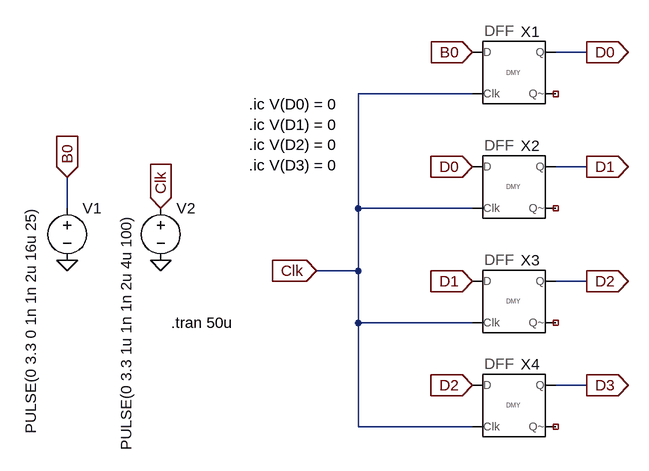
[diagram p0: schematic Shift_Right_Register_test.asc]
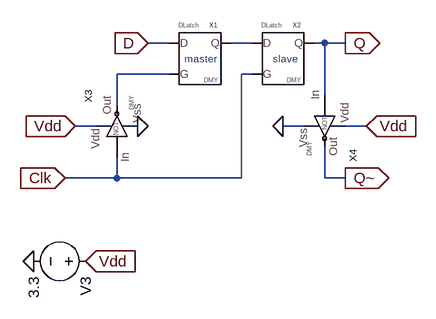
[diagram p1: sub-circuit dff.asc]
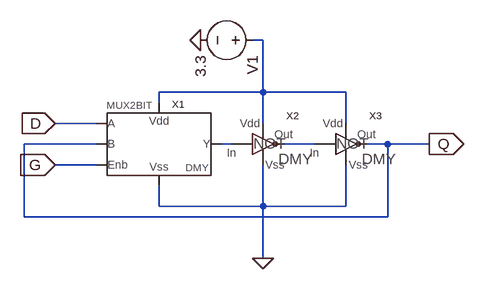
[diagram p2: sub-circuit d-latch.asc]
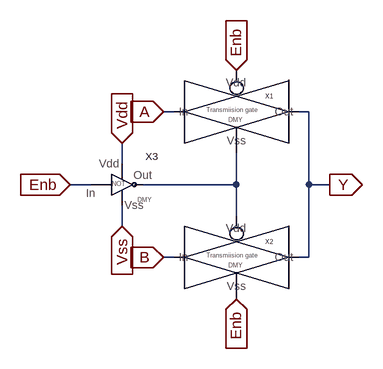
[diagram p3: sub-circuit mux2-1.asc]
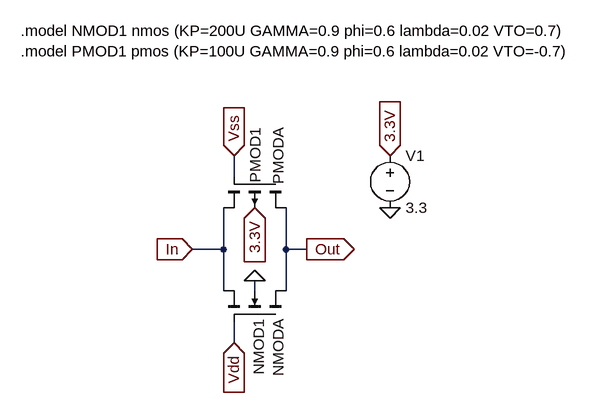
[diagram p4: sub-circuit transmissiongate.asc]
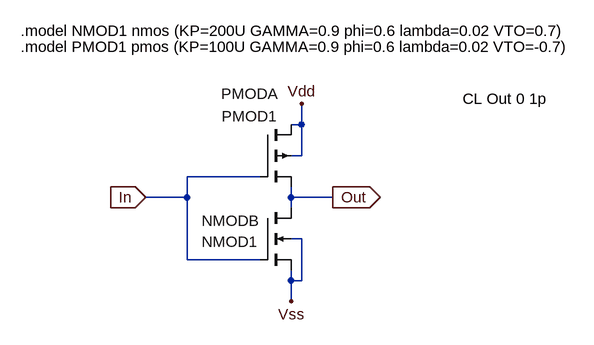
[diagram p5: sub-circuit not.asc]
Shift_Right_Register_test.asc, the LTspice schematic file:
Version 4
SHEET 1 880 792
WIRE 752 -304 704 -304
WIRE 576 -240 400 -240
WIRE 752 -128 704 -128
WIRE -48 -64 -48 -112
WIRE 400 -64 400 -240
WIRE 576 -64 400 -64
WIRE 400 32 400 -64
WIRE 400 32 336 32
WIRE 752 48 704 48
WIRE 400 112 400 32
WIRE 576 112 400 112
WIRE 752 208 704 208
WIRE 400 272 400 112
WIRE 576 272 400 272
FLAG -48 16 0
FLAG 96 16 0
FLAG -48 -112 B0
IOPIN -48 -112 In
FLAG 96 -64 Clk
IOPIN 96 -64 In
FLAG 576 -304 B0
IOPIN 576 -304 In
FLAG 576 -128 D0
IOPIN 576 -128 In
FLAG 576 48 D1
IOPIN 576 48 In
FLAG 576 208 D2
IOPIN 576 208 In
FLAG 336 32 Clk
IOPIN 336 32 In
FLAG 752 -304 D0
IOPIN 752 -304 Out
FLAG 752 -128 D1
IOPIN 752 -128 Out
FLAG 752 48 D2
IOPIN 752 48 Out
FLAG 752 208 D3
IOPIN 752 208 Out
SYMBOL voltage -48 -80 R0
WINDOW 3 -56 12 VRight 2
WINDOW 123 0 0 Left 0
WINDOW 39 0 0 Left 0
SYMATTR Value PULSE(0 3.3 0 1n 1n 2u 16u 25)
SYMATTR InstName V1
SYMBOL voltage 96 -80 R0
WINDOW 3 -53 24 VRight 2
WINDOW 123 0 0 Left 0
WINDOW 39 0 0 Left 0
SYMATTR Value PULSE(0 3.3 1u 1n 1n 2u 4u 100)
SYMATTR InstName V2
SYMBOL DFF 624 -288 R0
SYMATTR InstName X1
SYMBOL DFF 624 -112 R0
SYMATTR InstName X2
SYMBOL DFF 624 64 R0
SYMATTR InstName X3
SYMBOL DFF 624 224 R0
SYMATTR InstName X4
TEXT 112 112 Left 2 !.tran 50u
TEXT 232 -224 Left 2 !.ic V(D0) = 0\n.ic V(D1) = 0\n.ic V(D2) = 0\n.ic V(D3) = 0

dff.asc, the sub-circuit schematic file:
Version 4
SHEET 1 880 680
WIRE 240 128 208 128
WIRE 368 128 336 128
WIRE 480 128 464 128
WIRE 512 128 480 128
WIRE 240 176 160 176
WIRE 368 176 352 176
WIRE 480 208 480 128
WIRE 160 224 160 176
WIRE 128 256 96 256
WIRE 448 256 416 256
WIRE 544 256 512 256
WIRE 160 336 160 304
WIRE 160 336 80 336
WIRE 352 336 352 176
WIRE 352 336 160 336
WIRE 480 336 480 288
WIRE 512 336 480 336
FLAG 80 336 Clk
IOPIN 80 336 In
FLAG 208 128 D
IOPIN 208 128 In
FLAG 512 128 Q
IOPIN 512 128 Out
FLAG 32 464 0
FLAG 96 256 Vdd
IOPIN 96 256 In
FLAG 112 464 Vdd
IOPIN 112 464 In
FLAG 512 336 Q~
IOPIN 512 336 Out
FLAG 544 256 Vdd
IOPIN 544 256 In
FLAG 416 256 0
FLAG 192 256 0
SYMBOL D-Latch 288 160 R0
SYMATTR InstName X1
SYMBOL D-Latch 416 160 R0
SYMATTR InstName X2
SYMBOL NOT 160 272 R270
SYMATTR InstName X3
SYMBOL voltage 128 464 R90
WINDOW 123 0 0 Left 0
WINDOW 39 0 0 Left 0
SYMATTR InstName V3
SYMATTR Value 3.3
SYMBOL NOT 480 240 R90
SYMATTR InstName X4
TEXT 264 152 Left 1 ;master
TEXT 400 152 Left 1 ;slave

d-latch.asc, the sub-circuit schematic file:
Version 4
SHEET 1 880 680
WIRE 400 16 384 16
WIRE 400 96 400 16
WIRE 400 96 240 96
WIRE 528 96 400 96
WIRE 240 112 240 96
WIRE 144 144 80 144
WIRE 400 144 400 96
WIRE 528 144 528 96
WIRE 144 176 32 176
WIRE 352 176 336 176
WIRE 480 176 432 176
WIRE 592 176 560 176
WIRE 656 176 592 176
WIRE 144 208 80 208
WIRE 240 272 240 240
WIRE 400 272 400 208
WIRE 400 272 240 272
WIRE 528 272 528 208
WIRE 528 272 400 272
WIRE 32 288 32 176
WIRE 592 288 592 176
WIRE 592 288 32 288
WIRE 400 352 400 272
FLAG 656 176 Q
IOPIN 656 176 Out
FLAG 80 144 D
IOPIN 80 144 In
FLAG 80 208 G
IOPIN 80 208 In
FLAG 400 352 0
FLAG 304 16 0
SYMBOL MUX2-1 256 176 R0
SYMATTR InstName X1
SYMBOL NOT 384 176 R0
SYMATTR InstName X2
SYMBOL NOT 512 176 R0
SYMATTR InstName X3
SYMBOL voltage 400 16 R90
WINDOW 123 0 0 Left 0
WINDOW 39 0 0 Left 0
SYMATTR InstName V1
SYMATTR Value 3.3

mux2-1.asc, the sub-circuit schematic file:
Version 4
SHEET 1 880 680
WIRE 96 112 80 112
WIRE 304 112 288 112
WIRE 16 192 16 160
WIRE -32 224 -64 224
WIRE 192 224 192 176
WIRE 192 224 48 224
WIRE 304 224 304 112
WIRE 336 224 304 224
WIRE 192 272 192 224
WIRE 16 288 16 256
WIRE 96 336 80 336
WIRE 304 336 304 224
WIRE 304 336 288 336
FLAG -64 224 Enb
IOPIN -64 224 In
FLAG 80 112 A
IOPIN 80 112 In
FLAG 80 336 B
IOPIN 80 336 In
FLAG 192 400 Enb
IOPIN 192 400 In
FLAG 192 48 Enb
IOPIN 192 48 In
FLAG 336 224 Y
IOPIN 336 224 Out
FLAG 16 160 Vdd
IOPIN 16 160 In
FLAG 16 288 Vss
IOPIN 16 288 In
SYMBOL TransmissionGate 176 112 R0
SYMATTR InstName X1
SYMBOL TransmissionGate 176 336 R0
SYMATTR InstName X2
SYMBOL NOT 0 224 R0
SYMATTR InstName X3

transmissiongate.asc, the sub-circuit schematic file:
Version 4
SHEET 1 1240 680
WIRE 160 144 160 112
WIRE 144 256 144 192
WIRE 144 256 96 256
WIRE 240 256 240 192
WIRE 272 256 240 256
WIRE 144 320 144 256
WIRE 192 320 192 304
WIRE 240 320 240 256
WIRE 160 400 160 368
FLAG 96 256 In
IOPIN 96 256 In
FLAG 272 256 Out
IOPIN 272 256 Out
FLAG 160 112 Vss
IOPIN 160 112 In
FLAG 160 400 Vdd
IOPIN 160 400 In
FLAG 192 192 3.3V
IOPIN 192 192 In
FLAG 192 304 0
FLAG 400 192 0
FLAG 400 112 3.3V
IOPIN 400 112 In
SYMBOL pmos4 240 144 R90
WINDOW 0 -76 12 Left 2
WINDOW 3 -76 47 Left 2
SYMATTR InstName PMODA
SYMATTR Value PMOD1
SYMATTR Value2 l=1u w=50u
SYMBOL nmos4 240 368 M270
WINDOW 0 -83 12 Left 2
WINDOW 3 -81 42 Left 2
SYMATTR InstName NMODA
SYMATTR Value NMOD1
SYMATTR Value2 l=1u w=50u
SYMBOL voltage 400 96 R0
WINDOW 123 0 0 Left 0
WINDOW 39 0 0 Left 0
SYMATTR InstName V1
SYMATTR Value 3.3
TEXT -168 -80 Left 2 !.model NMOD1 nmos (KP=200U GAMMA=0.9 phi=0.6 lambda=0.02 VTO=0.7)\n.model PMOD1 pmos (KP=100U GAMMA=0.9 phi=0.6 lambda=0.02 VTO=-0.7)

not.asc, the sub-circuit schematic file:
Version 4
SHEET 1 880 680
WIRE 288 -96 288 -128
WIRE 288 -96 272 -96
WIRE 288 -48 288 -96
WIRE 288 -48 272 -48
WIRE 224 -16 112 -16
WIRE 112 16 112 -16
WIRE 112 16 48 16
WIRE 272 16 272 0
WIRE 336 16 272 16
WIRE 272 32 272 16
WIRE 112 112 112 16
WIRE 288 80 272 80
WIRE 224 112 112 112
WIRE 272 144 272 128
WIRE 288 144 288 80
WIRE 288 144 272 144
WIRE 272 176 272 144
FLAG 48 16 In
IOPIN 48 16 In
FLAG 336 16 Out
IOPIN 336 16 Out
FLAG 272 176 Vss
FLAG 288 -128 Vdd
SYMBOL pmos4 224 -96 R0
WINDOW 0 -60 -47 Left 2
WINDOW 3 -59 -13 Left 2
SYMATTR InstName PMODA
SYMATTR Value PMOD1
SYMATTR Value2 l=1u w=50u
SYMBOL nmos4 224 32 R0
WINDOW 0 -90 20 Left 2
WINDOW 3 -90 52 Left 2
SYMATTR InstName NMODB
SYMATTR Value NMOD1
SYMATTR Value2 l=1u w=100u
TEXT -144 -240 Left 2 !.model NMOD1 nmos (KP=200U GAMMA=0.9 phi=0.6 lambda=0.02 VTO=0.7)
TEXT -144 -216 Left 2 !.model PMOD1 pmos (KP=100U GAMMA=0.9 phi=0.6 lambda=0.02 VTO=-0.7)
TEXT 536 -136 Left 2 !CL Out 0 1p

The netlist it stands for:
* Shift_Right_Register_test.asc
V1 B0 0 PULSE(0 3.3 0 1n 1n 2u 16u 25)
V2 Clk 0 PULSE(0 3.3 1u 1n 1n 2u 4u 100)
XX1 B0 Clk D0 NC_01 dff
XX2 D0 Clk D1 NC_02 dff
XX3 D1 Clk D2 NC_03 dff
XX4 D2 Clk D3 NC_04 dff

* block symbol definitions
.subckt dff D Clk Q Q~
XX1 D N002 N001 d-latch
XX2 N001 Clk Q d-latch
XX3 Vdd 0 Clk N002 not
V3 Vdd 0 3.3
XX4 Vdd 0 Q Q~ not
* master
* slave
.ends dff

.subckt d-latch D G Q
XX1 D Q G N001 0 N002 mux2-1
XX2 N001 0 N002 N003 not
XX3 N001 0 N003 Q not
V1 N001 0 3.3
.ends d-latch

.subckt mux2-1 A B Enb Vdd Vss Y
XX1 Enb N001 Y A transmissiongate
XX2 N001 Enb Y B transmissiongate
XX3 Vdd Vss Enb N001 not
.ends mux2-1

.subckt transmissiongate Vdd Vss Out In
M§PMODA Out Vss In 3.3V PMOD1 l=1u w=50u
M§NMODA Out Vdd In 0 NMOD1 l=1u w=50u
V1 3.3V 0 3.3
.model NMOD1 nmos (KP=200U GAMMA=0.9 phi=0.6 lambda=0.02 VTO=0.7)
.model PMOD1 pmos (KP=100U GAMMA=0.9 phi=0.6 lambda=0.02 VTO=-0.7)
.ends transmissiongate

.subckt not Vdd Vss In Out
M§PMODA Vdd In Out Vdd PMOD1 l=1u w=50u
M§NMODB Out In Vss Vss NMOD1 l=1u w=100u
.model NMOD1 nmos (KP=200U GAMMA=0.9 phi=0.6 lambda=0.02 VTO=0.7)
.model PMOD1 pmos (KP=100U GAMMA=0.9 phi=0.6 lambda=0.02 VTO=-0.7)
CL Out 0 1p
.ends not

.model NMOS NMOS
.model PMOS PMOS
.lib standard.mos
.tran 50u
.ic V(D0) = 0
.ic V(D1) = 0
.ic V(D2) = 0
.ic V(D3) = 0
.backanno
.end